# Altium schematic sheet Sheet3.SchDoc
size A4
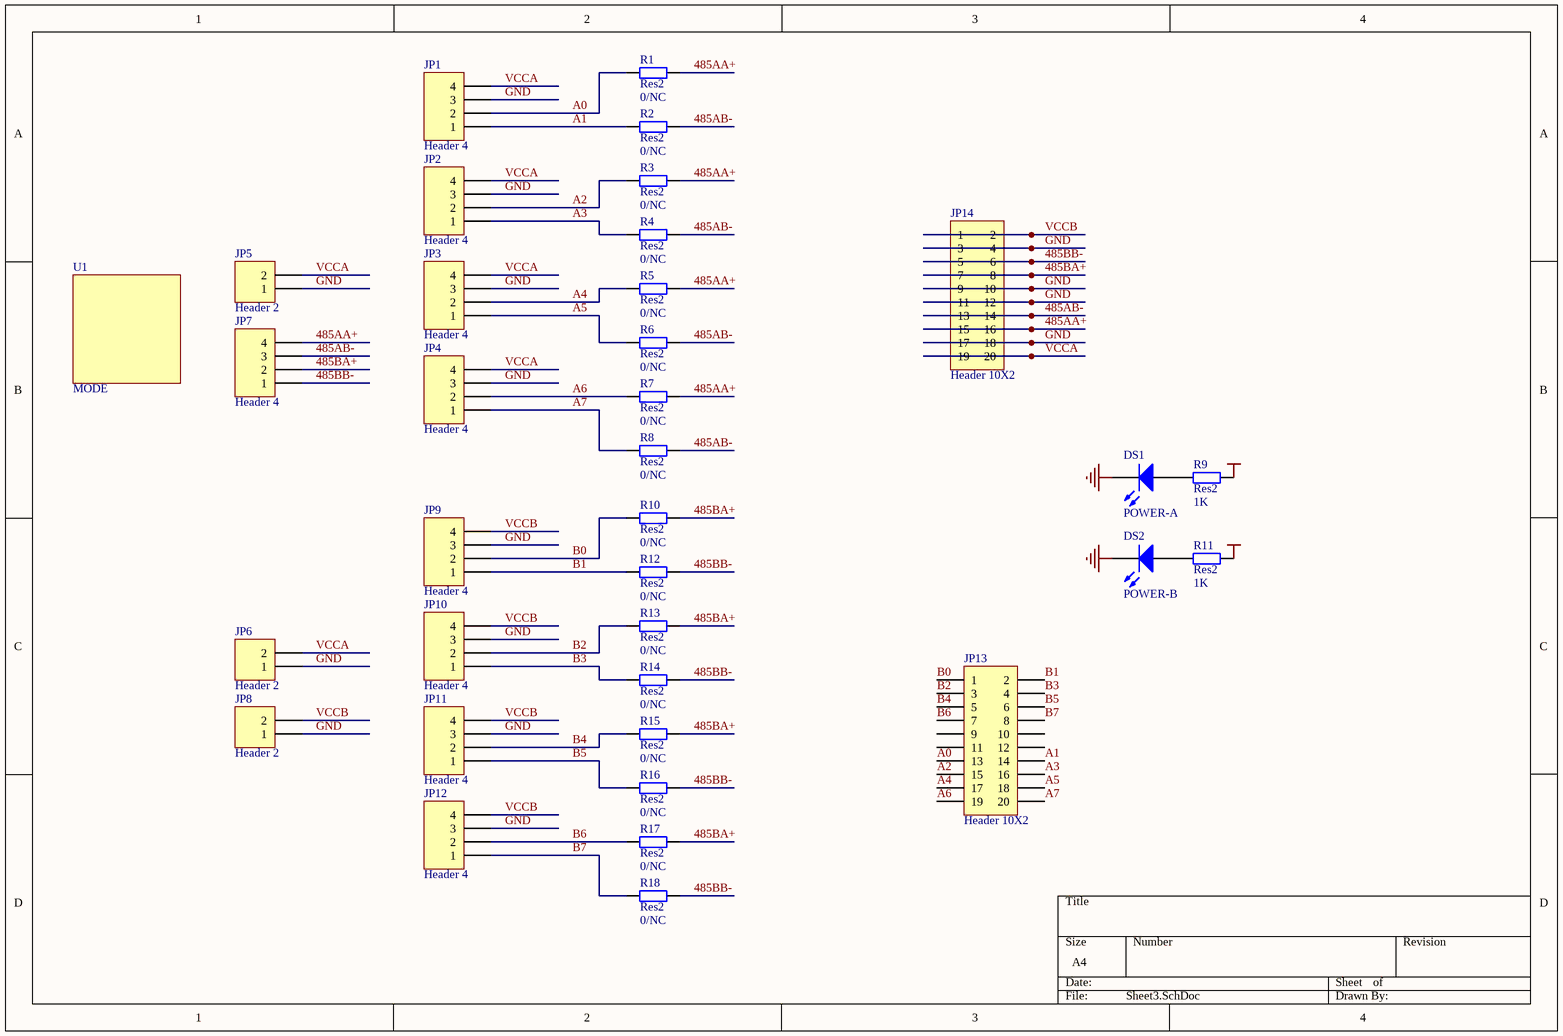
[diagram p0: Sheet3.SchDoc]

## Parts
DS1  POWER-A  [SMD _LED]
DS2  POWER-B  [SMD _LED]
JP1  Header 4  [duanzi-4]
JP2  Header 4  [duanzi-4]
JP3  Header 4  [duanzi-4]
JP4  Header 4  [duanzi-4]
JP5  Header 2  [duanzi-2]
JP6  Header 2  [duanzi-2]
JP7  Header 4  [duanzi-4]
JP8  Header 2  [duanzi-2]
JP9  Header 4  [duanzi-4]
JP10  Header 4  [duanzi-4]
JP11  Header 4  [duanzi-4]
JP12  Header 4  [duanzi-4]
JP13  Header 10X2  [HDR2X10]
JP14  Header 10X2  [HDR2X10]
R1  Res2  value 0/NC  [1206]
R2  Res2  value 0/NC  [1206]
R3  Res2  value 0/NC  [1206]
R4  Res2  value 0/NC  [1206]
R5  Res2  value 0/NC  [1206]
R6  Res2  value 0/NC  [1206]
R7  Res2  value 0/NC  [1206]
R8  Res2  value 0/NC  [1206]
R9  Res2  value 1K  [1206]
R10  Res2  value 0/NC  [1206]
R11  Res2  value 1K  [1206]
R12  Res2  value 0/NC  [1206]
R13  Res2  value 0/NC  [1206]
R14  Res2  value 0/NC  [1206]
R15  Res2  value 0/NC  [1206]
R16  Res2  value 0/NC  [1206]
R17  Res2  value 0/NC  [1206]
R18  Res2  value 0/NC  [1206]
U1  MODE  [sw-tcpip]

## Nets
GND: DS1.2(K) DS2.2(K) JP1.3 JP2.3 JP3.3 JP4.3 JP5.1 JP6.1 JP8.1 JP9.3 JP10.3 JP11.3 JP12.3 JP14.3 JP14.4 JP14.9 JP14.10 JP14.11 JP14.12 JP14.17 JP14.18
VCCA: JP1.4 JP2.4 JP3.4 JP4.4 JP5.2 JP6.2 JP14.19 JP14.20 R9.2
VCCB: JP8.2 JP9.4 JP10.4 JP11.4 JP12.4 JP14.1 JP14.2 R11.2
485AA+: JP7.4 JP14.15 JP14.16 R1.1 R3.1 R5.1 R7.1
485AB-: JP7.3 JP14.13 JP14.14 R2.1 R4.1 R6.1 R8.1
485BA+: JP7.2 JP14.7 JP14.8 R10.1 R13.1 R15.1 R17.1
485BB-: JP7.1 JP14.5 JP14.6 R12.1 R14.1 R16.1 R18.1
A0: JP1.2 JP13.13 R1.2
A1: JP1.1 JP13.14 R2.2
A2: JP2.2 JP13.15 R3.2
A3: JP2.1 JP13.16 R4.2
A4: JP3.2 JP13.17 R5.2
A5: JP3.1 JP13.18 R6.2
A6: JP4.2 JP13.19 R7.2
A7: JP4.1 JP13.20 R8.2
B0: JP9.2 JP13.1 R10.2
B1: JP9.1 JP13.2 R12.2
B2: JP10.2 JP13.3 R13.2
B3: JP10.1 JP13.4 R14.2
B4: JP11.2 JP13.5 R15.2
B5: JP11.1 JP13.6 R16.2
B6: JP12.2 JP13.7 R17.2
B7: JP12.1 JP13.8 R18.2
NetDS1_1: DS1.1(A) R9.1
NetDS2_1: DS2.1(A) R11.1

Not connected (* = marked no-connect by the designer): JP13 9 10 11 12

## Library data of the parts
DS1 DS2 = LED3: Typical BLUE SiC LED; Revision 1: Jul-2002: Re-released for DXP Platform.; Revision 2: 17-Dec-2003: PCB Footprint replaced.; Published: 8-Jun-2000; Publisher: Altium Limited
JP1-JP4 JP7 JP9-JP12 = Header 4: Header, 4-Pin; Revision: 17-Jul-2002: Re-released for DXP Platform.; Publisher: Altium Limited
JP5 JP6 JP8 = Header 2: Header, 2-Pin; Revision: 17-Jul-2002: Re-released for DXP Platform.; Publisher: Altium Limited
JP13 JP14 = Header 10X2: Header, 10-Pin, Dual row; Revision: 17-Jul-2002: Re-released for DXP Platform.; Publisher: Altium Limited
R1-R18 = Res2: Resistor; Published: 8-Jun-2000; Revision: July-2002: Re-released for DXP Platform.; Publisher: Altium Limited
U1 = PLL: Generic Phase Locked Loop; Code - JEDEC: MO-150-AA; Published: 8-Jun-2000; Revision: July-2002: Re-released for DXP Platform.; Publisher: Altium Limited